# EasyEDA schematic electricalCircuit.json
TITLE: Sheet_1; REV: 1.0; Date: 2025-03-10; Sheet: 1/1; Company: Your Company
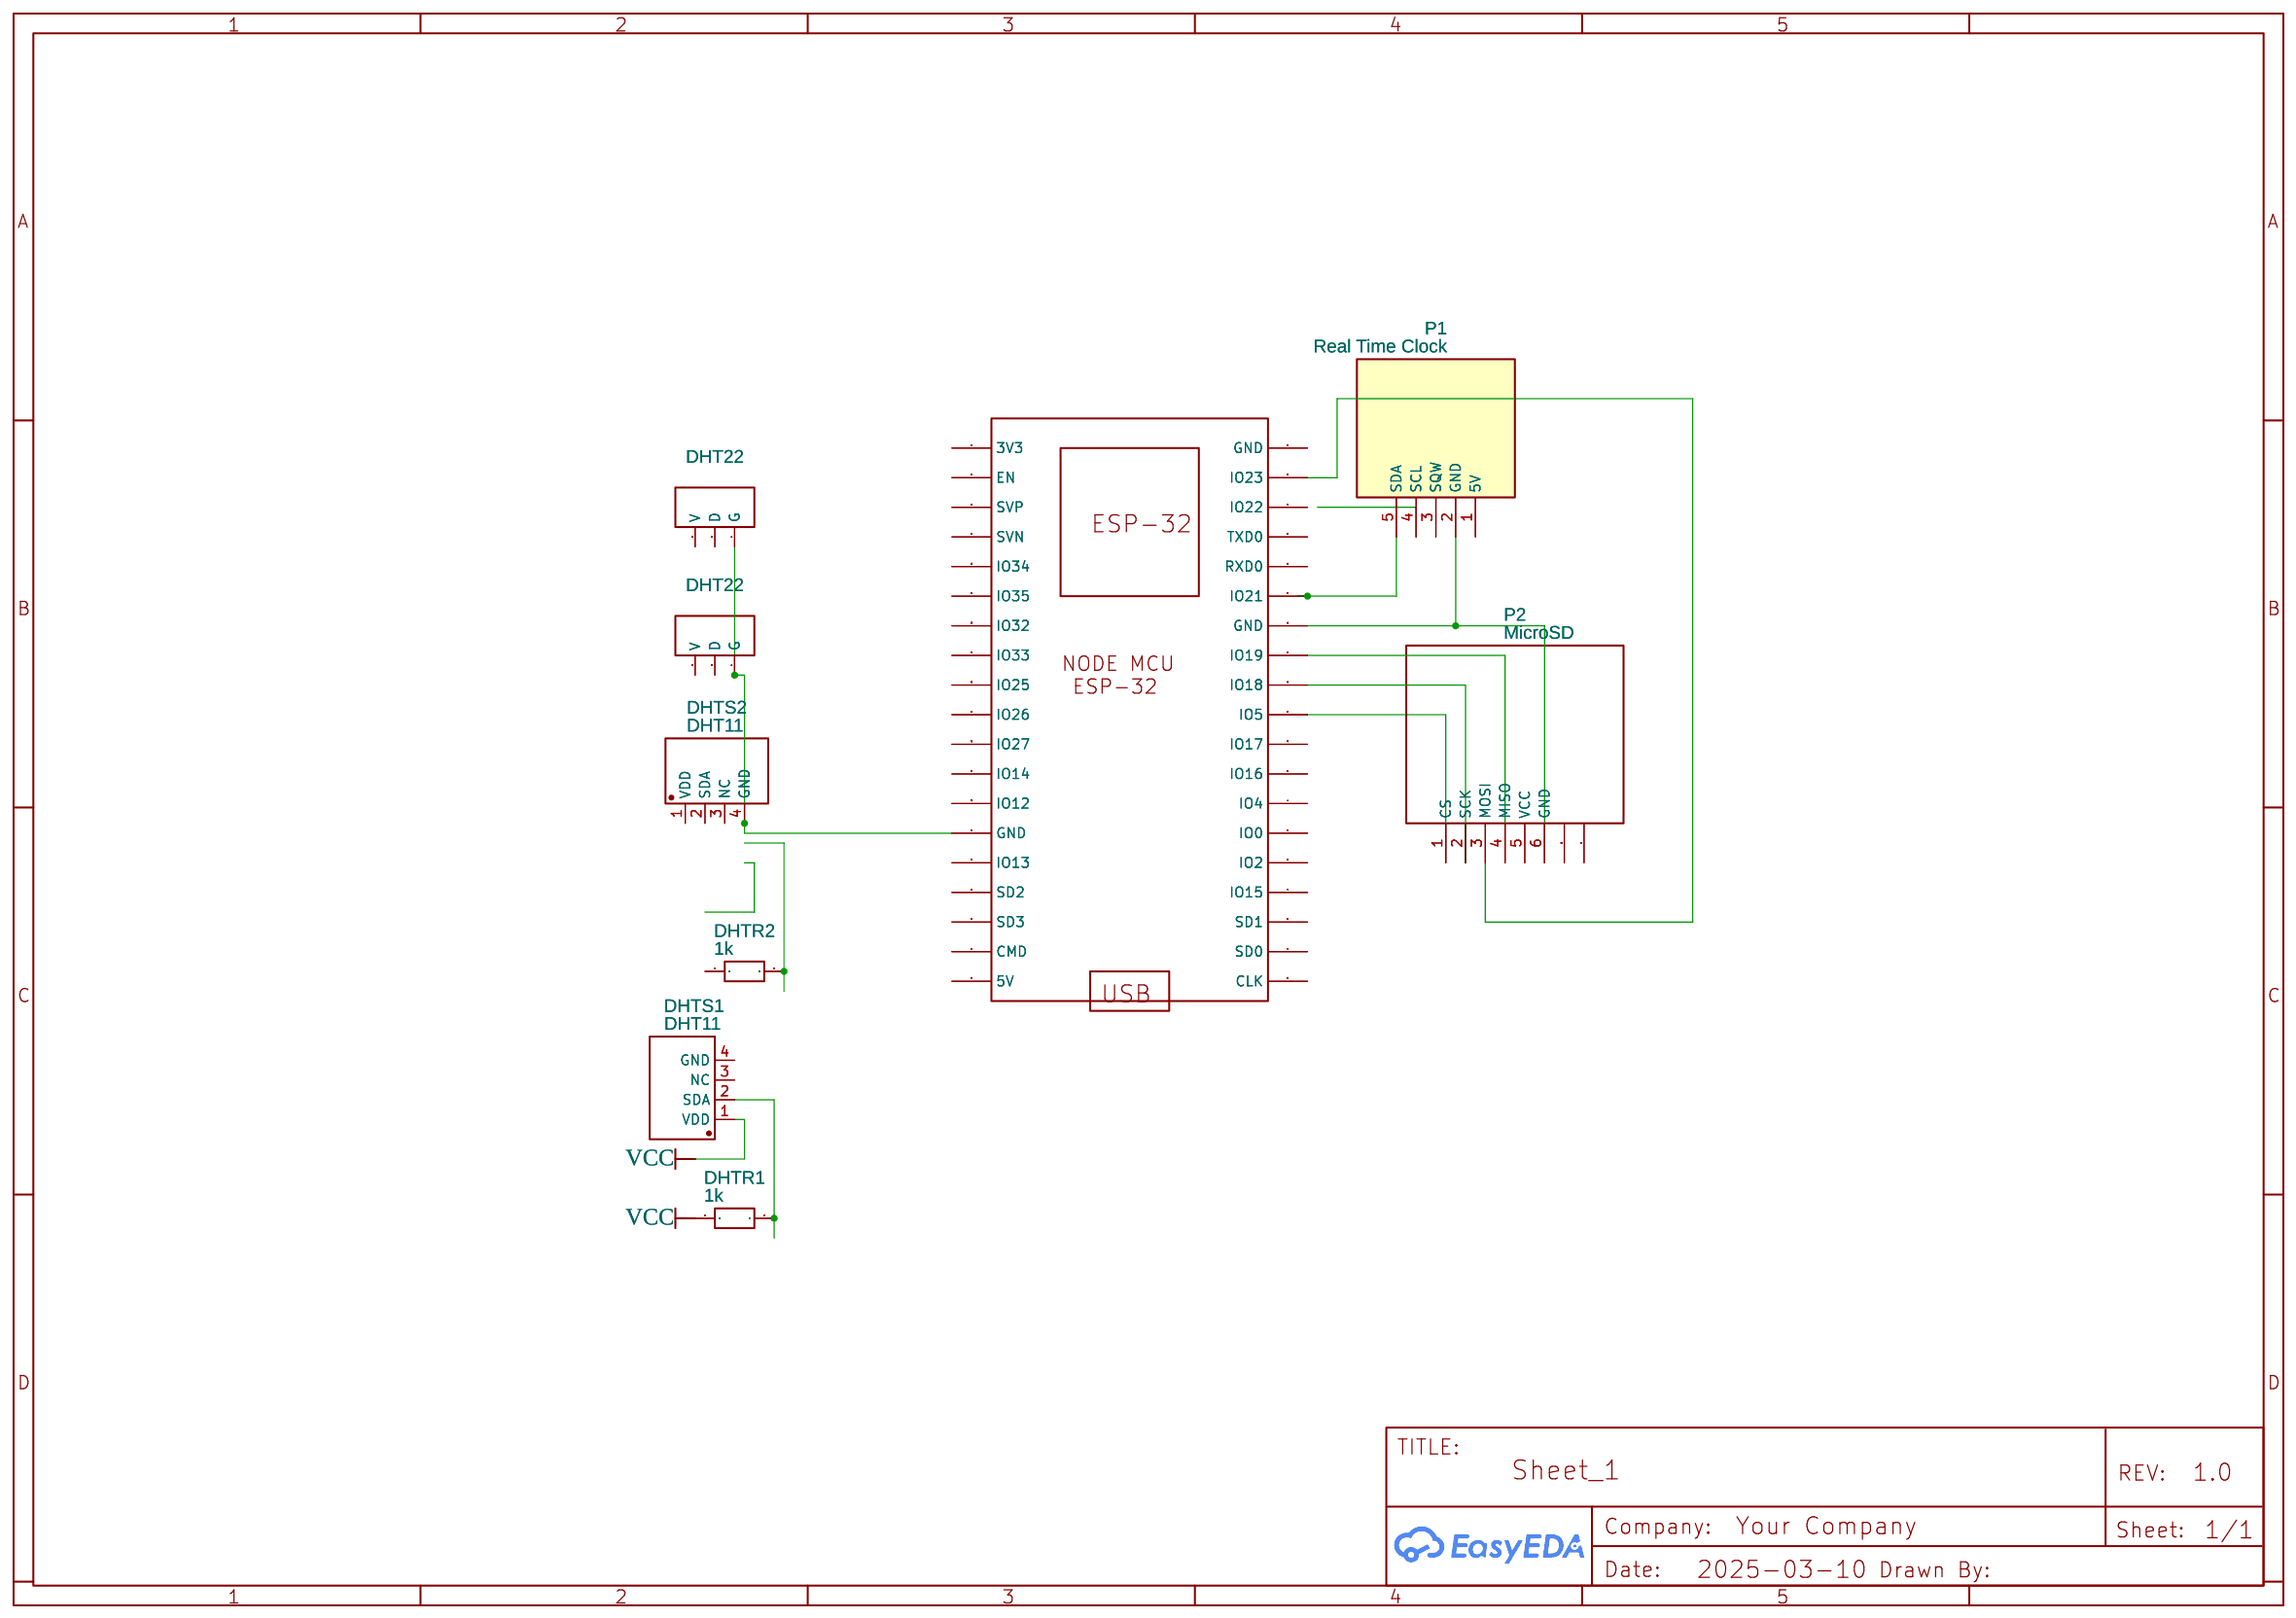
[diagram p0: schematic sheet]

## Parts
DHT22  HDR-M-2.54_1x3  [HDR-M-2.54_1X3]
DHT22#2  HDR-M-2.54_1x3  [HDR-M-2.54_1X3]
DHTR1  1k  [R0603]
DHTR2  1k  [R0603]
DHTS1  DHT11  [SENSOR-TH_AM2302]
DHTS2  DHT11  [SENSOR-TH_AM2302]
ESPESP32  none
ESPESP-1S  NODE MCU ESP-32S  [NODEMCU-32SLUA]
P1  Real Time Clock  [REAL TIME CLOCK]
P2  MicroSD  [MICROSD]

## Library data of the parts
DHT22 DHT22#2 = HDR-M-2.54_1x3: Supplier Part: C180248; Supplier: LCSC; Contributor: LCEDA_Lib
DHTR1 DHTR2 = R_0603_EU: Contributor: LCEDA_Lib
DHTS1 DHTS2 = AM2302: Supplier: LCSC; Manufacturer: AOSONG; Supplier Part: C83988
P1 = Real Time Clock: sourceId: 1T5FDZYC8
P2 = MicroSD: sourceId: 1T5FDZYC8

## Nets
VCC: DHTR1.2 DHTS1.1(VDD)
Net-(DHT22-1): DHT22.1(G) DHT22#2.1(G) DHTS2.4(GND) ESPESP-1S.D12(GND)
Net-(DHTR1-1): DHTR1.1 DHTS1.2(SDA)
Net-(ESPESP-1S-10): ESPESP-1S.10(IO5) P2.1(CS)
Net-(ESPESP-1S-11): ESPESP-1S.11(IO18) P2.2(SCK)
Net-(ESPESP-1S-12): ESPESP-1S.12(IO19) P2.4(MISO)
Net-(ESPESP-1S-13): ESPESP-1S.13(GND) P1.2(GND) P2.6(GND)
Net-(ESPESP-1S-14): ESPESP-1S.14(IO21) P1.5(SDA)
Net-(ESPESP-1S-18): ESPESP-1S.18(IO23) P2.3(MOSI)

Not connected (* = marked no-connect by the designer): DHT22 2(D) 3(V); DHT22#2 2(D) 3(V); DHTR2 1 2; DHTS1 3(NC) 4(GND); DHTS2 1(VDD) 2(SDA) 3(NC); ESPESP-1S 2(SD0) 3(SD1) 4(IO15) 5(IO2) 6(IO0) 7(IO4) 8(IO16) 9(IO17) 15(RXD0) 16(TXD0) 17(IO22) 19(GND) D6(CLK) D7(5V) D8(CMD) D9(SD3) D10(SD2) D11(IO13) D13(IO12) D14(IO14) D15(IO27) D16(IO26) D17(IO25) D18(IO33) D19(IO32) D20(IO35) D21(IO34) D22(SVN) D23(SVP) D24(EN) D25(3V3); P1 1(5V) 3(SQW) 4(SCL); P2 5(VCC) none
